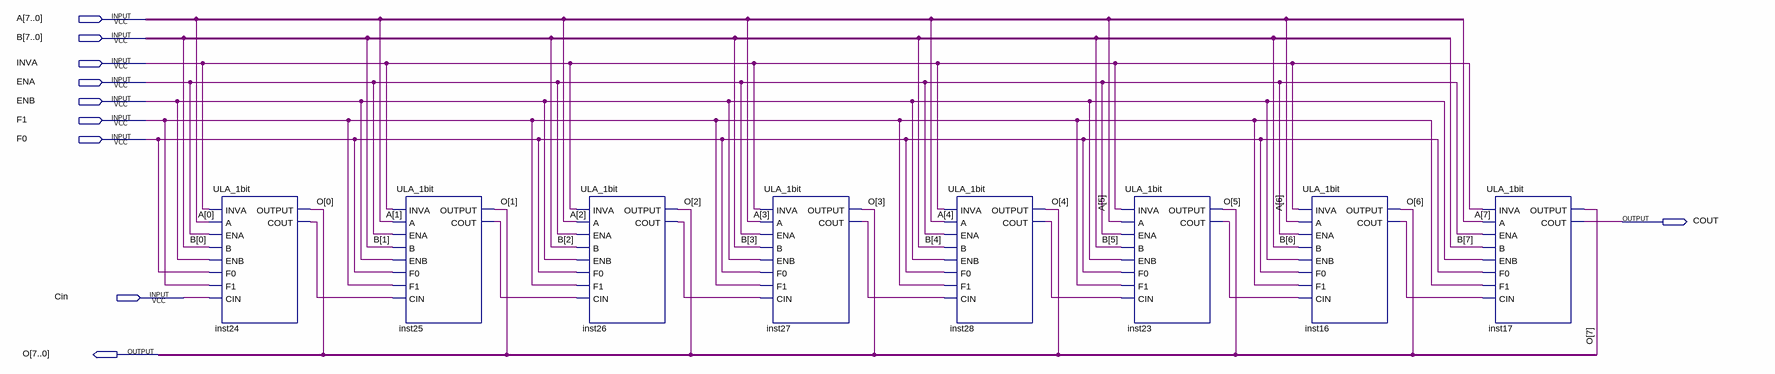
[diagram p0: schematic sheet]
// Quartus schematic ULA_8bits.bdf as structural Verilog: 8 symbols, 10 pins
module ULA_8bits (
  input  [7:0] A,
  input  [7:0] B,
  input  INVA,
  input  ENA,
  input  ENB,
  input  F1,
  input  F0,
  input  Cin,
  output COUT,
  output [7:0] O
);

  wire inst16_cout, inst23_cout, inst24_cout, inst25_cout, inst26_cout, inst27_cout, inst28_cout;

  ULA_1bit inst24 (
    .INVA(INVA), .A(A[0]), .ENA(ENA), .B(B[0]), .ENB(ENB), .F0(F0), .F1(F1), .CIN(Cin), .OUTPUT(O[0]),
    .COUT(inst24_cout));
  ULA_1bit inst25 (
    .INVA(INVA), .A(A[1]), .ENA(ENA), .B(B[1]), .ENB(ENB), .F0(F0), .F1(F1), .CIN(inst24_cout),
    .OUTPUT(O[1]), .COUT(inst25_cout));
  ULA_1bit inst26 (
    .INVA(INVA), .A(A[2]), .ENA(ENA), .B(B[2]), .ENB(ENB), .F0(F0), .F1(F1), .CIN(inst25_cout),
    .OUTPUT(O[2]), .COUT(inst26_cout));
  ULA_1bit inst27 (
    .INVA(INVA), .A(A[3]), .ENA(ENA), .B(B[3]), .ENB(ENB), .F0(F0), .F1(F1), .CIN(inst26_cout),
    .OUTPUT(O[3]), .COUT(inst27_cout));
  ULA_1bit inst28 (
    .INVA(INVA), .A(A[4]), .ENA(ENA), .B(B[4]), .ENB(ENB), .F0(F0), .F1(F1), .CIN(inst27_cout),
    .OUTPUT(O[4]), .COUT(inst28_cout));
  ULA_1bit inst23 (
    .INVA(INVA), .A(A[5]), .ENA(ENA), .B(B[5]), .ENB(ENB), .F0(F0), .F1(F1), .CIN(inst28_cout),
    .OUTPUT(O[5]), .COUT(inst23_cout));
  ULA_1bit inst16 (
    .INVA(INVA), .A(A[6]), .ENA(ENA), .B(B[6]), .ENB(ENB), .F0(F0), .F1(F1), .CIN(inst23_cout),
    .OUTPUT(O[6]), .COUT(inst16_cout));
  ULA_1bit inst17 (
    .INVA(INVA), .A(A[7]), .ENA(ENA), .B(B[7]), .ENB(ENB), .F0(F0), .F1(F1), .CIN(inst16_cout),
    .OUTPUT(O[7]), .COUT(COUT));
endmodule
